# EAGLE design xbeeboard (EAGLE 5.06)
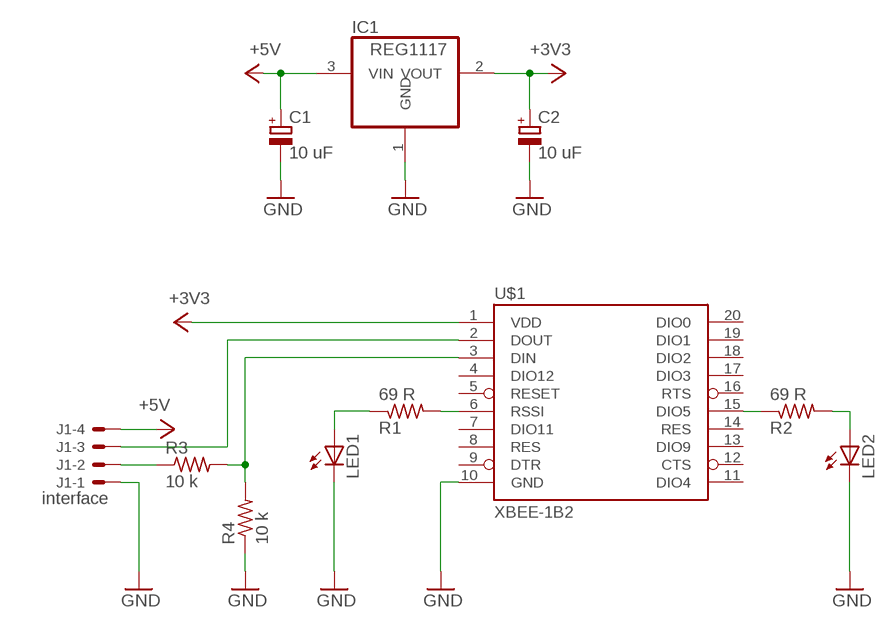
[diagram p0: schematic, sheet 1]

## Parts
C1  10 uF  CPOL-EUE2.5-5  [E2,5-5]
C2  10 uF  CPOL-EUE2.5-5  [E2,5-5]
IC1  REG1117  [SOT223]
J1  interface  22-05-7048-04  [7395-04]
LED1  LED3MM  [LED3MM]
LED2  LED3MM  [LED3MM]
R1  69 R  R-US_M0805  [M0805]
R2  69 R  R-US_M0805  [M0805]
R3  10 k  R-US_M0805  [M0805]
R4  10 k  R-US_M0805  [M0805]
U$1  XBEE-1B2  [XBEE-SILK]

## Nets
+3V3: C2.+ IC1.2(VOUT) U$1.1(VDD)
+5V: C1.+ IC1.3(VIN) J1.4
GND: C1.- C2.- IC1.1(GND) J1.1 LED1.K(C) LED2.K(C) R4.1 U$1.10(GND)
N$1: LED2.A R2.2
N$2: R3.2 R4.2 U$1.3(DIN)
N$3: J1.3 U$1.2(DOUT)
N$4: J1.2 R3.1
N$5: R2.1 U$1.15(DIO5)
N$6: LED1.A R1.1
N$7: R1.2 U$1.6(RSSI)
Unconnected: U$1.4(DIO12) U$1.5(RESET) U$1.7(DIO11) U$1.8(RES) U$1.9(DTR) U$1.11(DIO4) U$1.12(CTS) U$1.13(DIO9) U$1.14(RES) U$1.16(RTS) U$1.17(DIO3) U$1.18(DIO2) U$1.19(DIO1) U$1.20(DIO0)

## Library data of the parts
C1 C2 = rcl:CPOL-EU: POLARIZED CAPACITOR, European symbol
IC1 = burr-brown:REG1117: 800mA and 1A Low Dropout (LDO) Positive Regulator 1.8V, 2.5V, 2.85V, 3.3V, 5V, and Adj
J1 = con-molex:22-?-04: CONNECTOR wire to board 2.54 mm (.1 inch) pitch header
LED1 LED2 = led:LED: LED OSRAM: - CHIPLED LG R971, LG N971, LY N971, LG Q971, LY Q971, LO R971, LY R971 LH N974, LH R974 LS Q976, LO Q976, LY Q976 LO Q996 - Hyper CHIPLED LW Q18S LB Q993, LB Q99A, LB R99A - SideLED LS A670, LO A670, LY A670, LG A670, LP A670 LB A673, LV A673, LT A673, LW A673 LH A674 LY A675 LS A676, LA A676, LO A676, LY A676, LW A676 LS A679, LY A679, LG A679 - Hyper Micro SIDELED® LS Y876, LA Y876, LO Y876, LY Y876 LT Y87S - SmartLED LW L88C, LW L88S LB L89C, LB L89S, LG L890 LS L89K, LO L89K, LY L89K LS L896, LA L896, LO L896, LY L896 - TOPLED LS T670, LO T670, LY T670, LG T670, LP T670 LSG T670, LSP T670, LSY T670, LOP T670, LYG T670 LG T671, LOG T671, LSG T671 LB T673, LV T673, LT T673, LW T673 LH T674 LS T676, LA T676, LO T676, LY T676, LB T676, LH T676, LSB T676, LW T676 LB T67C, LV T67C, LT T67C, LS T67K, LO T67K, LY T67K, LW E67C LS E67B, LA E67B, LO E67B, LY E67B, LB E67C, LV E67C, LT E67C LW T67C LS T679, LY T679, LG T679 LS T770, LO T770, LY T770, LG T770, LP T770 LB T773, LV T773, LT T773, LW T773 LH T774 LS E675, LA E675, LY E675, LS T675 LS T776, LA T776, LO T776, LY T776, LB T776 LHGB T686 LT T68C, LB T68C - Hyper Mini TOPLED® LB M676 - Mini TOPLED Santana® LG M470 LS M47K, LO M47K, LY M47K Source: http://www.osram.convergy.de LUXEON: - LUMILED® LXK2-PW12-R00, LXK2-PW12-S00, LXK2-PW14-U00, LXK2-PW14-V00 LXK2-PM12-R00, LXK2-PM12-S00, LXK2-PM14-U00 LXK2-PE12-Q00, LXK2-PE12-R00, LXK2-PE12-S00, LXK2-PE14-T00, LXK2-PE14-U00 LXK2-PB12-K00, LXK2-PB12-L00, LXK2-PB12-M00, LXK2-PB14-N00, LXK2-PB14-P00, LXK2-PB14-Q00 LXK2-PR12-L00, LXK2-PR12-M00, LXK2-PR14-Q00, LXK2-PR14-R00 LXK2-PD12-Q00, LXK2-PD12-R00, LXK2-PD12-S00 LXK2-PH12-R00, LXK2-PH12-S00 LXK2-PL12-P00, LXK2-PL12-Q00, LXK2-PL12-R00 Source: www.luxeon.com KINGBRIGHT: KA-3528ASYC Source: www.kingbright.com
R1-R4 = resistor:R-US_: RESISTOR, American symbol
U$1 = SparkFun:XBEE-1

## Board
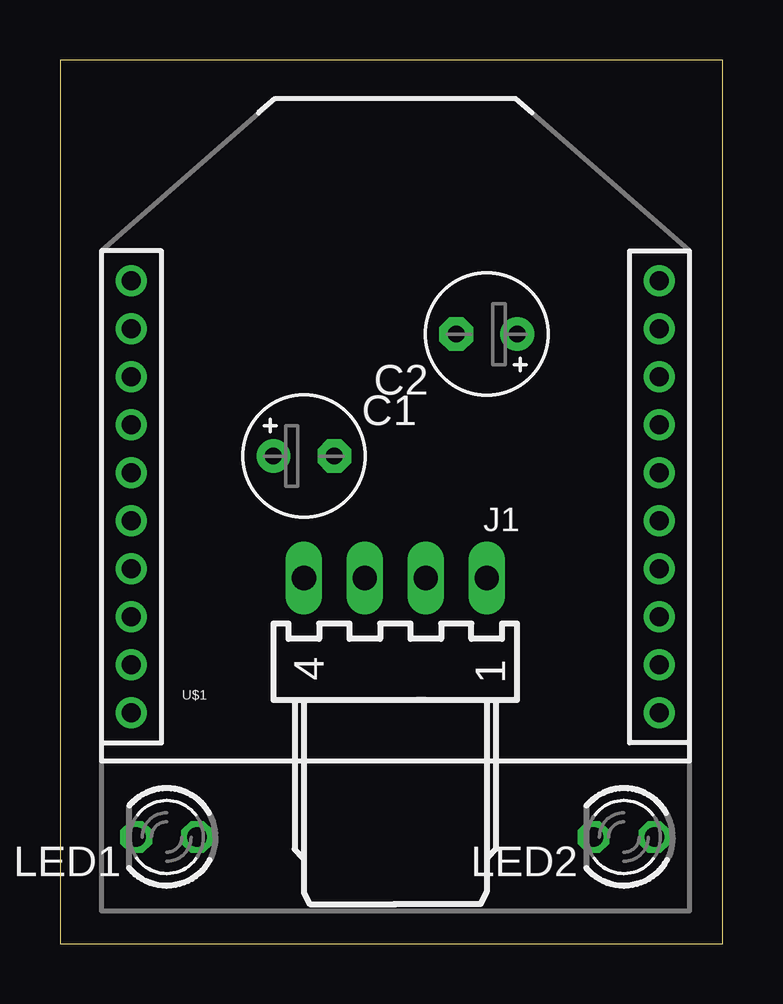
[diagram p1: board, top side]
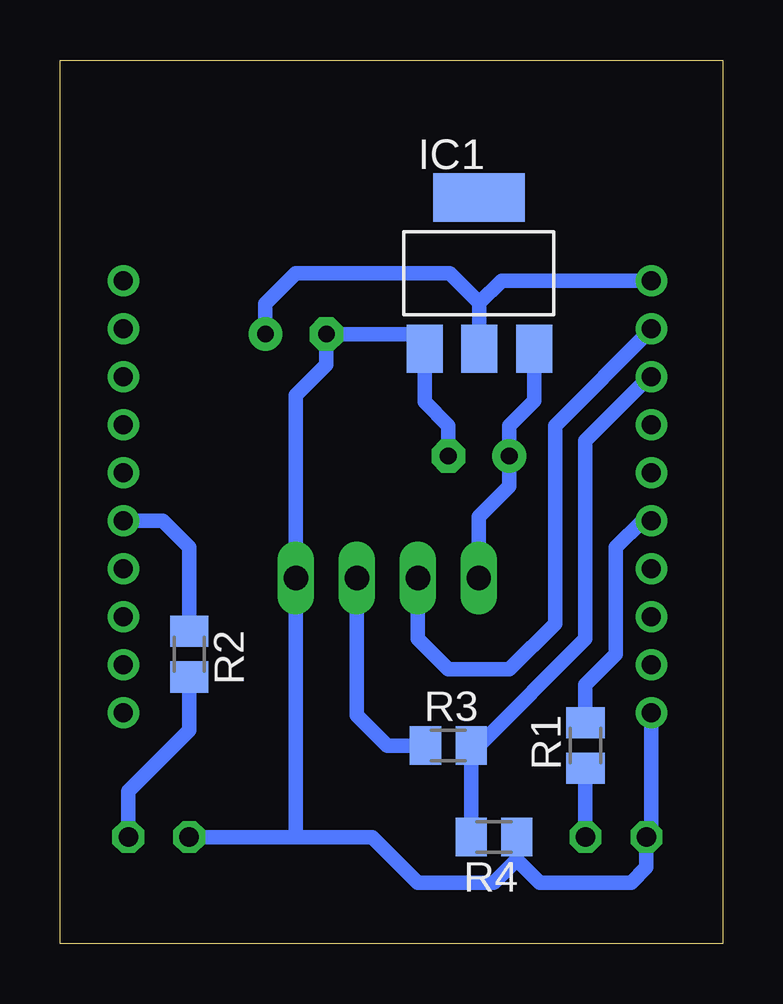
[diagram p2: board, bottom side, seen from below]

Size 27.61 x 36.82 mm. Coordinates in mm from the lower left corner, seen from the top.
Outline: 0,0 27.61,0 27.61,36.82 0,36.82 0,0
Copper layers (1*16): Top 0.035mm / dielectric 1.5mm / Bottom 0.035mm
Design rules "default": minimum track width 10mil, minimum drill 24mil, track to track 8mil, track to pad 8mil, pad to pad 8mil, via to via 8mil, smd to smd 8mil, copper to edge 40mil, drill to drill 8mil, minimum pad ring 10mil, minimum via ring 8mil, stop-mask expansion 4mil, vias tented up to drill 0mil, thermal gap 10mil

### Footprints (pad centres in the part's own frame; a part is rotated, then mirrored left to right if it is on the bottom)
E2,5-5 = drill 0.7 pad 1.4 round: + -1.27,0 | drill 0.7 pad 1.4 octagon: - 1.27,0
SOT223 = smd 1.499 x 2.007: 1 -2.261,-3.15; 2 0.025,-3.15; 3 2.311,-3.15 | smd 3.81 x 2.007: 4 0,3.15
7395-04 = drill 1.016 long: 1 3.81,0; 2 1.27,0; 3 -1.27,0; 4 -3.81,0
LED3MM = drill 0.813 octagon: A -1.27,0; K 1.27,0
M0805 = smd 1.3 x 1.6: 1 -0.95,0; 2 0.95,0
XBEE-SILK = drill 0.8 round: 1 -11,20; 2 -11,18; 3 -11,16; 4 -11,14; 5 -11,12; 6 -11,10; 7 -11,8; 8 -11,6; 9 -11,4; 10 -11,2; 11 11,2; 12 11,4; 13 11,6; 14 11,8; 15 11,10; 16 11,12; 17 11,14; 18 11,16; 19 11,18; 20 11,20

### Placement (x,y rotation side)
C1  10.16,20.32 0 top
C2  17.78,25.4 180 top
IC1  10.16,27.94 0 bottom
J1  13.97,15.24 0 top
LED1  4.45,4.45 180 top
LED2  23.5,4.45 180 top
R1  5.71,8.25 90 bottom
R2  22.22,12.06 270 bottom
R3  11.43,8.25 0 bottom
R4  9.53,4.45 180 bottom
U$1  13.97,7.62 0 top

### Tracks (layer width: path | path; a pad name or v marks a point on that pad's centre or on a via)
+3V3
  Bottom 0.61: U$1.1 9.21,27.62 10.14,26.7 | 10.14,26.7 IC1.2 | 10.14,26.7 11.38,27.94 17.78,27.94 19.05,26.67 C2.+
+5V
  Bottom 0.61: IC1.3 7.85,22.63 8.89,21.59 C1.+ 8.89,19.05 10.16,17.78 J1.4
GND
  Bottom 0.406: LED1.K 2.97,4.65
  Bottom 0.61: C1.- 11.43,21.59 12.42,22.58 IC1.1 12.42,25.12 12.7,25.4 C2.- 16.51,24.13 17.78,22.86 J1.1 17.78,4.45 | 2.97,4.65 U$1.10 | 8.57,3.49 R4.1 | 8.57,3.49 7.62,2.54 3.81,2.54 3.18,3.17 LED1.K | 17.78,4.45 14.61,4.45 12.7,2.54 9.53,2.54 8.57,3.49 | 17.78,4.45 LED2.K
N$1
  Bottom 0.61: LED2.A 24.77,6.35 22.22,8.89 R2.2
N$2
  Bottom 0.61: U$1.3 3.05,23.62 5.71,20.95 5.71,12.7 10.16,8.25 R3.2 R4.2
N$3
  Bottom 0.61: U$1.2 2.96,25.62 6.98,21.59 6.98,13.34 8.89,11.43 11.43,11.43 12.7,12.7 J1.3
N$4
  Bottom 0.61: J1.2 15.24,9.52 13.97,8.25 R3.1
N$5
  Bottom 0.61: U$1.15 23.34,17.62 22.22,16.51 R2.1
N$6
  Bottom 0.61: R1.1 LED1.A
N$7
  Bottom 0.61: U$1.6 3.34,17.62 4.45,16.51 4.45,12.06 5.71,10.8 R1.2